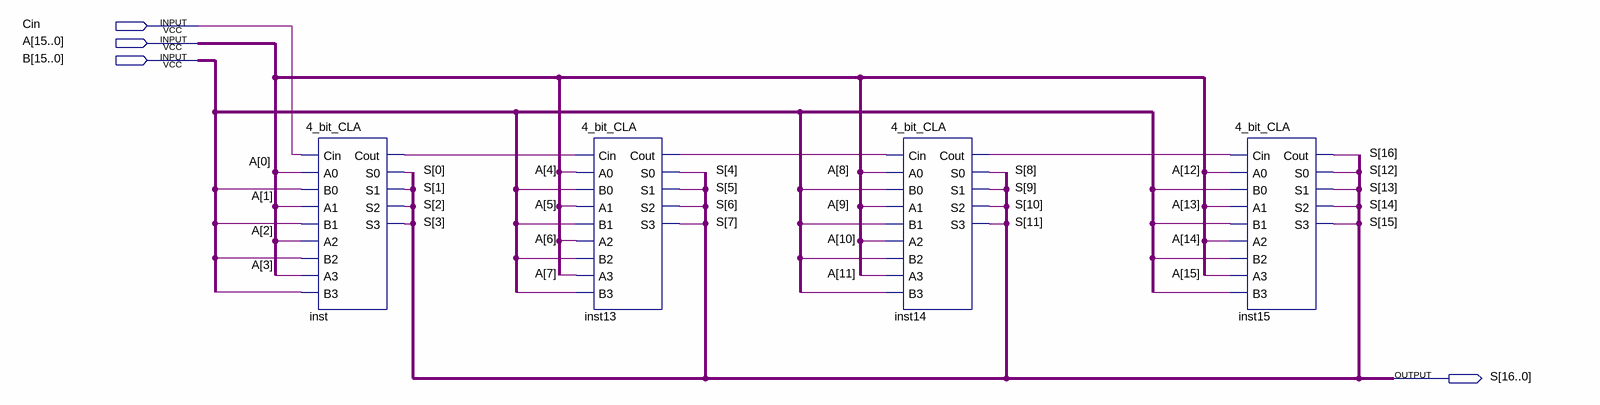
[diagram p0: schematic sheet]
// Quartus schematic 16_bit_CLA.bdf as structural Verilog: 4 symbols, 4 pins
module \16_bit_CLA  (
  input  Cin,
  input  [15:0] A,
  input  [15:0] B,
  output [16:0] S
);

  wire inst13_cout, inst14_cout, inst_cout;

  \4_bit_CLA  inst (
    .Cin(Cin), .A0(A[0]), .B0(B[0]), .A1(A[1]), .B1(B[1]), .A2(A[2]), .B2(B[2]), .A3(A[3]), .B3(B[3]),
    .S0(S[0]), .S1(S[1]), .S2(S[2]), .Cout(inst_cout), .S3(S[3]));
  \4_bit_CLA  inst13 (
    .Cin(inst_cout), .A0(A[4]), .B0(B[4]), .A1(A[5]), .B1(B[5]), .A2(A[6]), .B2(B[6]), .A3(A[7]), .B3(B[7]),
    .S0(S[4]), .S1(S[5]), .S2(S[6]), .Cout(inst13_cout), .S3(S[7]));
  \4_bit_CLA  inst14 (
    .Cin(inst13_cout), .A0(A[8]), .B0(B[8]), .A1(A[9]), .B1(B[9]), .A2(A[10]), .B2(B[10]), .A3(A[11]),
    .B3(B[11]), .S0(S[8]), .S1(S[9]), .S2(S[10]), .Cout(inst14_cout), .S3(S[11]));
  \4_bit_CLA  inst15 (
    .Cin(inst14_cout), .A0(A[12]), .B0(B[12]), .A1(A[13]), .B1(B[13]), .A2(A[14]), .B2(B[14]), .A3(A[15]),
    .B3(B[15]), .S0(S[12]), .S1(S[13]), .S2(S[14]), .Cout(S[16]), .S3(S[15]));
endmodule
